# EAGLE design Satellite_Transceiver_Function_Board__Swarm_M138 (EAGLE 9.6.2)
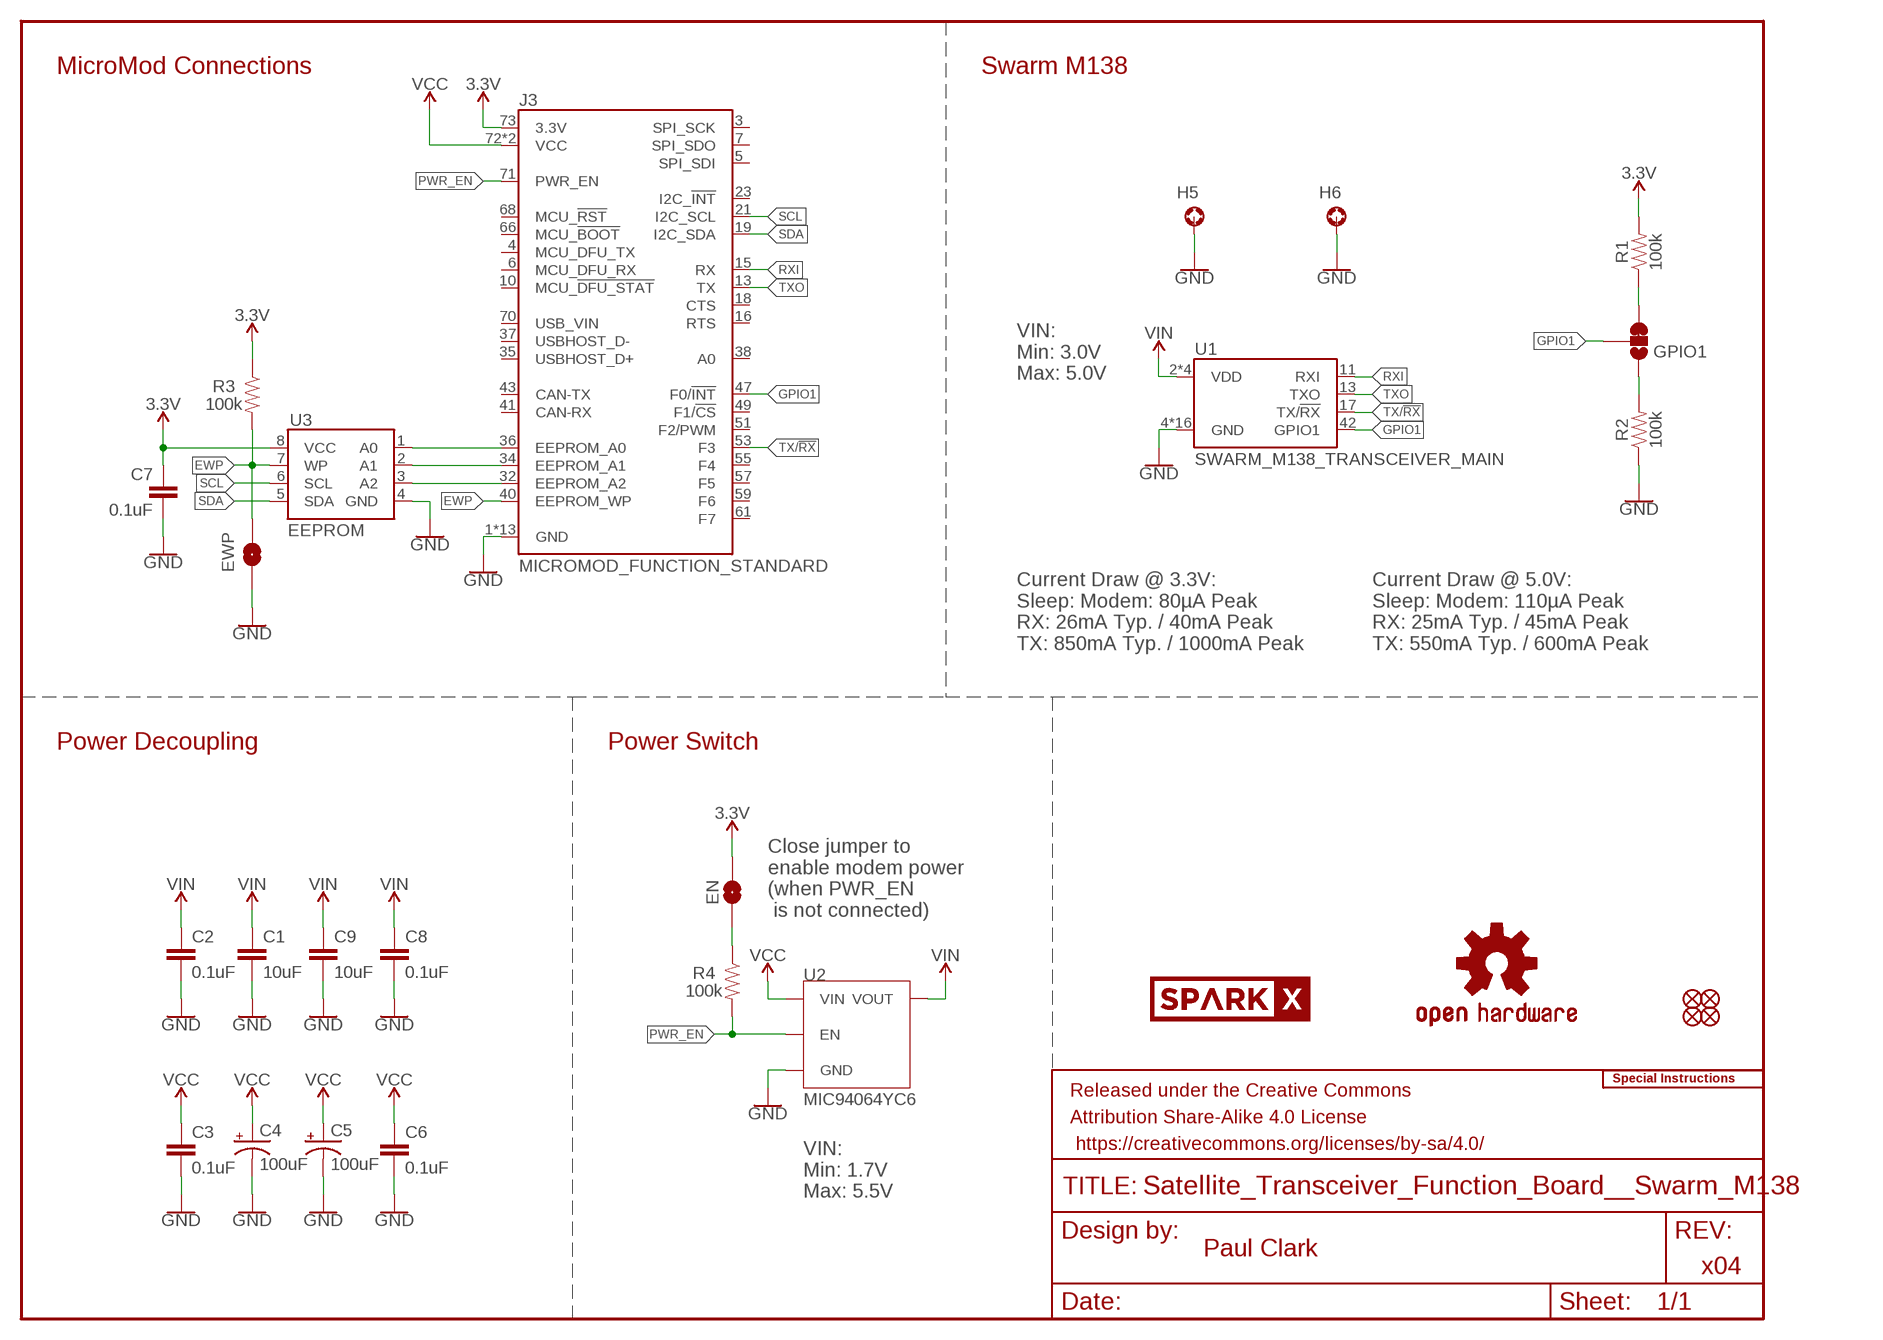
[diagram p0: schematic, sheet 1]

## Parts
C1  10uF  10UF-0603-6.3V-20%  [0603]
C2  0.1uF  0.1UF-0603-25V-5%  [0603]
C3  0.1uF  0.1UF-0603-25V-5%  [0603]
C4  100uF  100UF-POLAR-EIA3528-10V-20%(TANT)  [EIA3528]
C5  100uF  100UF-POLAR-EIA3528-10V-20%(TANT)  [EIA3528]
C6  0.1uF  0.1UF-0603-25V-5%  [0603]
C7  0.1uF  0.1UF-0603-25V-5%  [0603]
C8  0.1uF  0.1UF-0603-25V-5%  [0603]
C9  10uF  10UF-0603-6.3V-20%  [0603]
EN  JUMPER-SMT_2_NO_SILK  [SMT-JUMPER_2_NO_SILK]
EWP  JUMPER-SMT_2_NO_SILK  [SMT-JUMPER_2_NO_SILK]
FD1  FIDUCIAL1X2  [FIDUCIAL-1X2]
FD2  FIDUCIAL1X2  [FIDUCIAL-1X2]
FD3  FIDUCIAL1X2  [FIDUCIAL-1X2]
FD4  FIDUCIAL1X2  [FIDUCIAL-1X2]
FRAME1  FRAME-LETTER  [CREATIVE_COMMONS]
GPIO1  JUMPER-SMT_3_1-NC_TRACE_SILK  [SMT-JUMPER_3_1-NC_TRACE_SILK]
H5  STAND-OFF-REFLOW-M2.5_1.5MM_TALL  [STAND-OFF-REFLOW-M2.5]
H6  STAND-OFF-REFLOW-M2.5_1.5MM_TALL  [STAND-OFF-REFLOW-M2.5]
J3  MICROMOD_FUNCTION_STANDARD  [M.2-CARD-E-22_FUNCTION_STANDARD]
LOGO1  SPECIAL_INSTRUCTIONS-ORDERING  [ORDERING_INSTRUCTIONS]
LOGO2  OSHW-LOGOS  [OSHW-LOGO-S]
R1  100k  100KOHM-0603-1/10W-1%  [0603]
R2  100k  100KOHM-0603-1/10W-1%  [0603]
R3  100k  100KOHM-0603-1/10W-1%  [0603]
R4  100k  100KOHM-0603-1/10W-1%  [0603]
U1  SWARM_M138_TRANSCEIVER_MAIN  [M.2-SWARM-M138-A]
U2  MIC94064YC6  MIC94064/5_MIC94064YC6  [SC-70-6]
U3  EEPROM  EEPROM-I2C512K  [SO08]
U$1  SPARKX-LOGO5  [SPARKX-LARGE]
U$2  SPARKX-LOGO5  [SPARKX-LARGE]

## Nets
3.3V: C7.1 EN.2 J3.73(3.3V) R1.2 R3.1 U3.8(VCC)
A0 [DIGITAL]: J3.36(EEPROM_A0) U3.1(A0)
A1 [DIGITAL]: J3.34(EEPROM_A1) U3.2(A1)
A2 [DIGITAL]: J3.32(EEPROM_A2) U3.3(A2)
EWP [DIGITAL]: EWP.2 J3.40(EEPROM_WP) R3.2 U3.7(WP)
GND: C1.2 C2.2 C3.2 C4.C(-) C5.C(-) C6.2 C7.2 C8.2 C9.2 EWP.1 H5.1 H6.1 J3.1(GND) J3.2(GND) J3.8(GND) J3.33(GND) J3.39(GND) J3.45(GND) J3.75(GND) J3.GND1(GND) J3.GND2(GND) J3.GND3(GND) J3.GND4(GND) J3.GND5(GND) J3.GND6(GND) R2.1 U1.4(GND) U1.9(GND) U1.15(GND) U1.18(GND) U1.21(GND) U1.26(GND) U1.27(GND) U1.29(GND) U1.34(GND) U1.35(GND) U1.37(GND) U1.40(GND) U1.43(GND) U1.50(GND) U1.A1(GND) U1.A2(GND) U2.2(GND) U2.5(GND) U3.4(GND)
GPIO1: GPIO1.2 J3.47(F0/!INT!) U1.42(GPIO1)
N$1: EN.1 R4.1
N$14: GPIO1.3 R1.1
N$16: GPIO1.1 R2.2
PWR_EN: J3.71(PWR_EN) R4.2 U2.3(EN)
RXI: J3.15(RX) U1.11(RXI)
SCL [DIGITAL]: J3.21(I2C_SCL) U3.6(SCL)
SDA [DIGITAL]: J3.19(I2C_SDA) U3.5(SDA)
TX/!RX!: J3.53(F3) U1.17(TX/!RX!)
TXO: J3.13(TX) U1.13(TXO)
VCC: C3.1 C4.A(+) C5.A(+) C6.1 J3.72(VCC) J3.74(VCC) U2.4(VIN)
VIN: C1.1 C2.1 C8.1 C9.1 U1.2(VDD) U1.39(VDD) U1.41(VDD) U1.52(VDD) U2.1(VOUT)
Unconnected: J3.3(SPI_SCK) J3.4(MCU_DFU_TX) J3.5(SPI_SDI) J3.6(MCU_DFU_RX) J3.7(SPI_SDO) J3.10(MCU_!DFU_STAT!) J3.16(RTS) J3.18(CTS) J3.23(I2C_!INT!) J3.35(USBHOST_D+) J3.37(USBHOST_D-) J3.38(A0) J3.41(CAN-RX) J3.43(CAN-TX) J3.49(F1/!CS!) J3.51(F2/PWM) J3.55(F4) J3.57(F5) J3.59(F6) J3.61(F7) J3.66(MCU_!BOOT!) J3.68(MCU_!RST!) J3.70(USB_VIN)

## Notes on the sheet
- MicroMod Connections | Swarm M138
- VIN:
  Min: 3.0V
  Max: 5.0V
- Current Draw @ 3.3V:
  Sleep: Modem: 80µA Peak
  RX: 26mA Typ. / 40mA Peak
  TX: 850mA Typ. / 1000mA Peak
- Current Draw @ 5.0V:
  Sleep: Modem: 110µA Peak
  RX: 25mA Typ. / 45mA Peak
  TX: 550mA Typ. / 600mA Peak
- Power Decoupling | Power Switch
- Close jumper to
  enable modem power
  (when PWR_EN
   is not connected)
- VIN:
  Min: 1.7V
  Max: 5.5V
- Paul Clark
- x04

## Library data of the parts
C1 C9 = SparkFun-Capacitors:10UF: 10.0µF ceramic capacitors A capacitor is a passive two-terminal electrical component used to store electrical energy temporarily in an electric field.; PROD_ID: CAP-11015
C2 C3 C6-C8 = SparkFun-Capacitors:0.1UF: 0.1µF ceramic capacitors A capacitor is a passive two-terminal electrical component used to store electrical energy temporarily in an electric field.; PROD_ID: CAP-08604
C4 C5 = SparkFun-Capacitors:100UF-POLAR: 100µF polarized capacitors A capacitor is a passive two-terminal electrical component used to store electrical energy temporarily in an electric field.; PROD_ID: CAP-16823
EN EWP = SparkFun-Jumpers:JUMPER-SMT_2_NO: Normally open jumper This jumper has two pads in close proximity to each other. Apply solder to close the connection. Round pads are easier to solder for beginners, but are a lot larger. SparkFun Product that uses the round pads: SparkFun EL Sequencer <https://www.sparkfun.com/products/12781>
FD1-FD4 = SparkFun-Aesthetics:FIDUCIAL: Fiducial Alignment Points Point-of-reference for pick-and-place machines and other optical instruments.
FRAME1 = SparkFun-Aesthetics:FRAME-LETTER: Schematic Frame - Letter Standard 8.5x11 US Letter frame
GPIO1 = SparkFun-Jumpers:JUMPER-SMT_3_1-NC_TRACE: Normally closed trace jumper (1 of 2 connections) This jumper has a trace between two pads so it's normally closed (NC). The other connection is normally open (NO). Use a razor knife to open the connection. For best results follow the IPC guidelines for cutting traces: Cutout at least 0.063 mm (0.005 in). Remove all loose material to clean up the cut area. Seal the cut with an approved epoxy. Reapply solder to reclose the connection, or to close the NO connection.
H5 H6 = SparkFun-Hardware:STAND-OFF-REFLOW: Stand Off Reflow Compatible A metal standoff that can be placed and reflowed onto a PCB. The M2.5 x 2.5mm variant is used on MicroMod. The M2.5 x 1.5mm variant is used to hold mPCIe boards, including the Swarm M138. The M2.0 x 6.0mm variant is used to mount the Iridium 9603N modem.; PROD_ID: HW-16629
J3 = SparkFun-MicroMod:MICROMOD_FUNCTION: MicroMod Connector Description: A card edge connector and mating PCB connector to allow various MicroMod Processor Boards to be coupled with various carrier boards of different capabilities. Based on the M.2 standard.
LOGO1 = SparkFun-Aesthetics:SPECIAL_INSTRUCTIONS: Special Ordering/Production Instructions Alert Symbol for special PCB ordering instructions or unique production process warnings. Ordering Instructions Production Instructions Types of information that should be added to box: Copper weight Soldermask color Silk color PCB thickness Number of layers PCB Standard: 1.6mm FR4 1 oz copper immersion silver plating red soldermask white silkscreen Types of information that should be added to box: Special wash requirements Depaneling instructions Humidification Glue curing Default text settings: 0.07 inch 9% ratio 50% line distance
LOGO2 = SparkFun-Aesthetics:OSHW-LOGO: Open-Source Hardware (OSHW) Logo This logo indicates the piece of hardware it is found on incorporates a OSHW license and/or adheres to the definition of open source hardware found here: http://freedomdefined.org/OSHW
R1-R4 = SparkFun-Resistors:100KOHM: 100kΩ resistor A resistor is a passive two-terminal electrical component that implements electrical resistance as a circuit element. Resistors act to reduce current flow, and, at the same time, act to lower voltage levels within circuits. - Wikipedia; PROD_ID: RES-07828
U1 = SparkFun-RF:SWARM_M138_TRANSCEIVER: Swarm M138 Modem Description: A satellite transceiver based on the mPCIe standard.; PROD_ID: CONN-16558
U2 = SparkFun-IC-Power:MIC94064/5: The MIC94064 and MIC94065 are high-side load switches designed for operation between 1.7V to 5.5V. The devices contain a low on-resistance P-channel MOSFET that supports over 2A of continuous current. The MIC94064/5 provides a slew rate controlled SoftStart turn-on of 115µs (typical) to prevent in-rush current from glitching supply rails. The MIC94065 features an active load discharge circuit which insures capacitive loads retain no charge when the main switch is in an OFF state. An active pull-down on the enable input keeps MIC94064/5 in a default OFF state until the EN pin is pulled to a high level. Built-in level shift circuitry allows low voltage logic signals to switch higher supply voltages, or vice versa; high level logic signals can control low level voltages. Datasheet <http://ww1.microchip.com/downloads/en/DeviceDoc/mic94064-5.pdf>; PROD_ID: IC-16794
U3 = SparkFun-IC-Memory:EEPROM-I2C: I2C EEPROMs, 24LC256 and others 24LC256 Series 256 kb I2C 2 Wire (32 k x 8 Bit) 2.5 V Serial EEPROM SMD - SOIC-8 Datasheet SparkFun Products SparkFun UDB5 - PIC UAV Development Board <https://www.sparkfun.com/products/11703> (GPS-11703); PROD_ID: IC-14645
U$1 U$2 = SparkX:SPARKX-LOGO

## Net classes
4 3.3V: width 0.2 mm, clearance 0.2 mm to class 1
10 DIGITAL: width 0.09 mm, clearance 0.1 mm to class 0, clearance 0.1 mm to class 1, clearance 0.1 mm

## Board
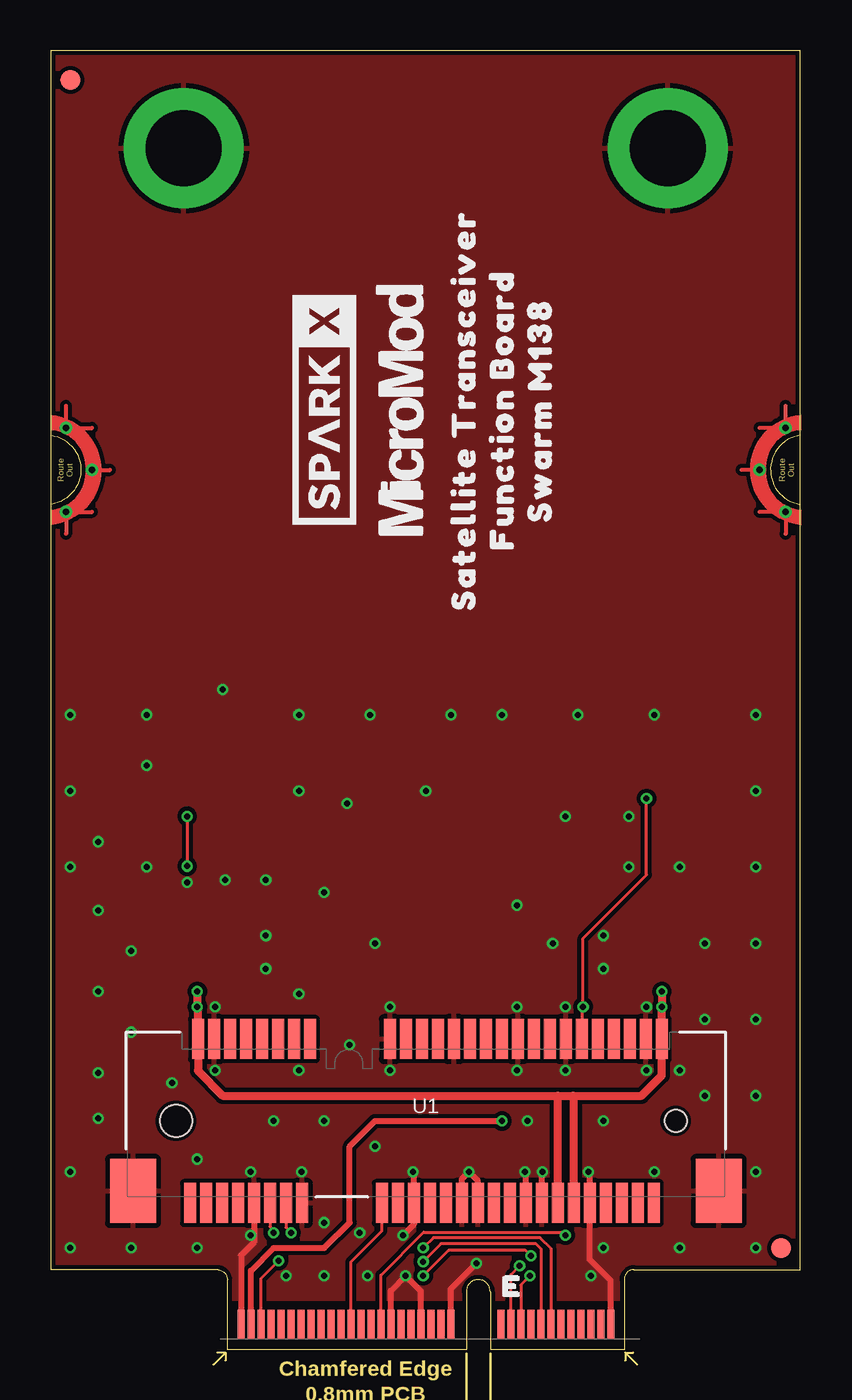
[diagram p1: board, top side]
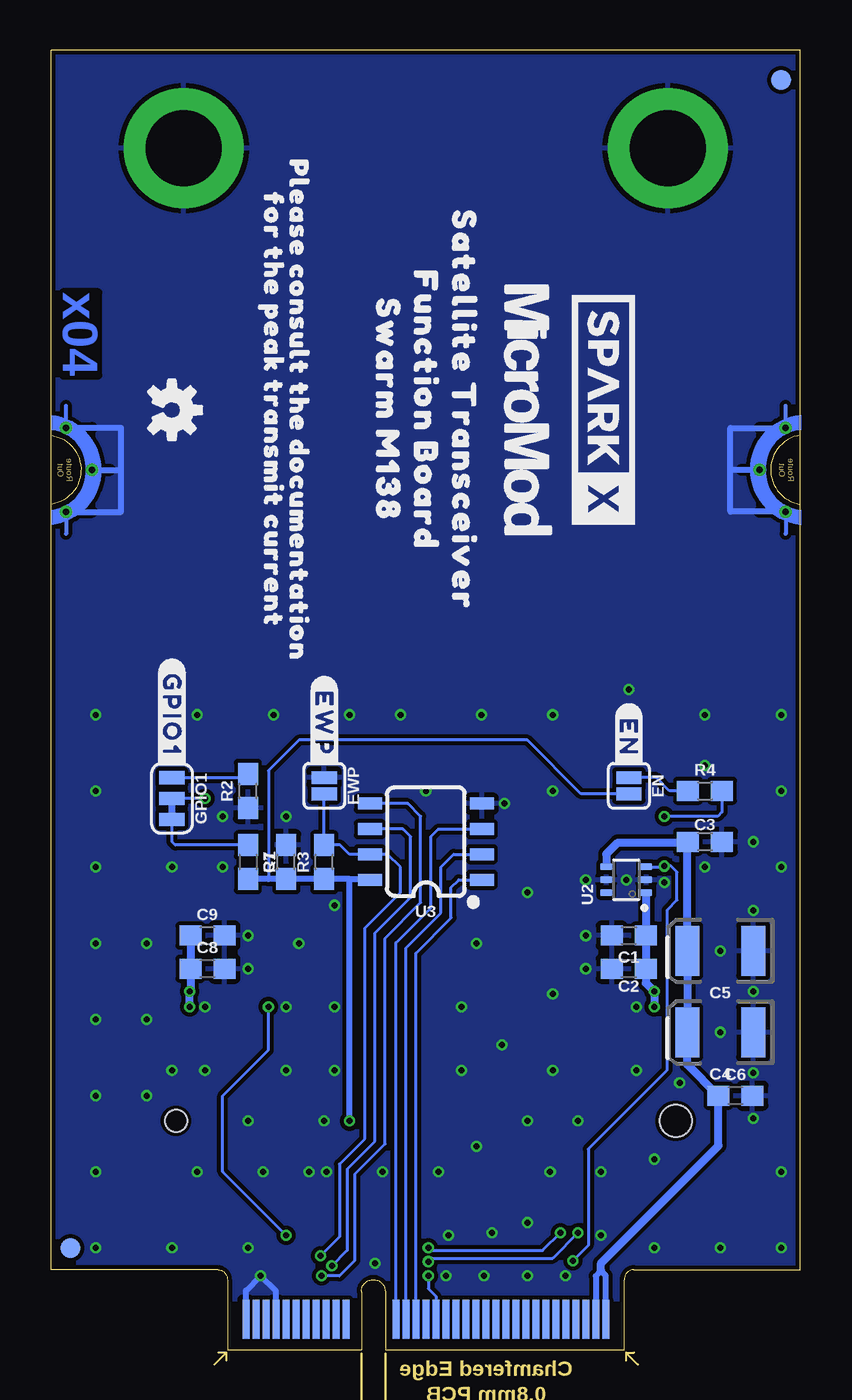
[diagram p2: board, bottom side, seen from below]

Size 37.5 x 65 mm. Coordinates in mm from the lower left corner, seen from the top.
Outline: 28.67,0 21.97,0 21.97,2.9 arc180 20.77,2.9 20.77,0 8.82,0 8.82,3.5 arc84 8.35,4 0,4 0,65 37.49,65 37.49,4 29.15,4 arc85 28.67,3.5 28.67,0
Copper layers (1*16): Top 0.035mm / dielectric 1.5mm / Bottom 0.035mm
Design rules "SparkFun-2-Layer-Minimum-JLCPCB": minimum track width 5mil, minimum drill 0.3mm, track to track 5mil, track to pad 5mil, pad to pad 5mil, via to via 5mil, smd to smd 5mil, copper to edge 7mil, drill to drill 7mil, minimum pad ring 5mil, minimum via ring 5mil, stop-mask expansion 2.5mil, vias tented up to drill 25mil, thermal gap 10mil
tRestrict: 2 lines

### Footprints (pad centres in the part's own frame; a part is rotated, then mirrored left to right if it is on the bottom)
0603 = smd 1.1 x 1: 1 -0.85,0; 2 0.85,0
EIA3528 = smd 1.2 x 2.5: A 1.65,0; C -1.65,0
SMT-JUMPER_2_NO_SILK = smd 0.635 x 1.27: 1 -0.406,0; 2 0.406,0
FIDUCIAL-1X2 = smd 1 x 1: 1 0,0
SMT-JUMPER_3_1-NC_TRACE_SILK = smd 0.66 x 1.27: 1 -1.041,0; 2 0,0; 3 1.041,0
STAND-OFF-REFLOW-M2.5 = drill 3.8 pad 6: 1 0,0
M.2-CARD-E-22_FUNCTION_STANDARD = smd 0.35 x 1.45: 1 9.25,1.275; 3 8.75,1.275; 5 8.25,1.275; 7 7.75,1.275; 9 7.25,1.275; 11 6.75,1.275; 13 6.25,1.275; 15 5.75,1.275; 17 5.25,1.275; 19 4.75,1.275; 21 4.25,1.275; 23 3.75,1.275; 33 1.25,1.275; 35 0.75,1.275; 37 0.25,1.275; 39 -0.25,1.275; 41 -0.75,1.275; 43 -1.25,1.275; 45 -1.75,1.275; 47 -2.25,1.275; 49 -2.75,1.275; 51 -3.25,1.275; 53 -3.75,1.275; 55 -4.25,1.275; 57 -4.75,1.275; 59 -5.25,1.275; 61 -5.75,1.275; 63 -6.25,1.275; 65 -6.75,1.275; 67 -7.25,1.275; 69 -7.75,1.275; 71 -8.25,1.275; 73 -8.75,1.275; 75 -9.25,1.275 | smd 0.35 x 1.95 bottom: 2 9,1.525; 4 8.5,1.525; 6 8,1.525; 8 7.5,1.525; 10 7,1.525; 12 6.5,1.525; 14 6,1.525; 16 5.5,1.525; 18 5,1.525; 20 4.5,1.525; 22 4,1.525; 32 1.5,1.525; 34 1,1.525; 36 0.5,1.525; 38 0,1.525; 40 -0.5,1.525; 42 -1,1.525; 44 -1.5,1.525; 46 -2,1.525; 48 -2.5,1.525; 50 -3,1.525; 52 -3.5,1.525; 54 -4,1.525; 56 -4.5,1.525; 58 -5,1.525; 60 -5.5,1.525; 62 -6,1.525; 64 -6.5,1.525; 66 -7,1.525; 68 -7.5,1.525; 70 -8,1.525; 72 -8.5,1.525; 74 -9,1.525 | drill 0.305 pad 0.61: GND1 -18,41.9; GND2 -16.7,44; GND3 -18,46.1; GND4 18,41.9; GND5 16.7,44; GND6 18,46.1
M.2-SWARM-M138-A = smd 0.6 x 2: 1 -11.8,-4.1; 2 -11.4,4.1; 3 -11,-4.1; 4 -10.6,4.1; 5 -10.2,-4.1; 6 -9.8,4.1; 7 -9.4,-4.1; 8 -9,4.1; 9 -8.6,-4.1; 10 -8.2,4.1; 11 -7.8,-4.1; 12 -7.4,4.1; 13 -7,-4.1; 14 -6.6,4.1; 15 -6.2,-4.1; 16 -5.8,4.1; 17 -2.2,-4.1; 18 -1.8,4.1; 19 -1.4,-4.1; 20 -1,4.1; 21 -0.6,-4.1; 22 -0.2,4.1; 23 0.2,-4.1; 24 0.6,4.1; 25 1,-4.1; 26 1.4,4.1; 27 1.8,-4.1; 28 2.2,4.1; 29 2.6,-4.1; 30 3,4.1; 31 3.4,-4.1; 32 3.8,4.1; 33 4.2,-4.1; 34 4.6,4.1; 35 5,-4.1; 36 5.4,4.1; 37 5.8,-4.1; 38 6.2,4.1; 39 6.6,-4.1; 40 7,4.1; 41 7.4,-4.1; 42 7.8,4.1; 43 8.2,-4.1; 44 8.6,4.1; 45 9,-4.1; 46 9.4,4.1; 47 9.8,-4.1; 48 10.2,4.1; 49 10.6,-4.1; 50 11,4.1; 51 11.4,-4.1; 52 11.8,4.1 | smd 2.3 x 3.2: A1 -14.65,-3.5; A2 14.65,-3.5 | hole 1.1: 12.5,0 | hole 1.6: -12.5,0
SC-70-6 = smd 0.35 x 0.6: 1 -0.65,-1; 2 0,-1; 3 0.65,-1; 4 0.65,1; 5 0,1; 6 -0.65,1
SO08 = smd 0.6 x 1.2: 1 -1.905,-2.8; 2 -0.635,-2.8; 3 0.635,-2.8; 4 1.905,-2.8; 5 1.905,2.8; 6 0.635,2.8; 7 -0.635,2.8; 8 -1.905,2.8

### Placement (x,y rotation side)
C1  8.59,20.7 180 bottom
C2  8.59,19.05 180 bottom
C3  4.78,25.4 0 bottom
C4  4.02,15.88 180 bottom
C5  4.02,19.94 180 bottom
C6  3.25,12.7 0 bottom
C7  25.73,24.38 90 bottom
C8  29.67,19.05 0 bottom
C9  29.67,20.7 0 bottom
EN  8.59,28.19 270 bottom
EWP  23.83,28.19 270 bottom
FD1  36.53,5.08 0 top
FD2  36.53,5.08 0 bottom
FD3  0.97,63.5 0 top
FD4  0.97,63.5 0 bottom
FRAME1  72.09,1.27 0 top  (outside the outline)
GPIO1  31.45,27.56 270 bottom
H5  6.65,60.08 0 top
H6  30.85,60.08 0 top
J3  18.75,0 0 top
LOGO1  44.15,62.23 0 top  (outside the outline)
LOGO2  31.45,46.99 270 bottom
R1  27.64,24.38 270 bottom
R2  27.64,27.94 90 bottom
R3  23.83,24.38 90 bottom
R4  4.78,27.94 0 bottom
U1  18.75,11.43 0 top
U2  8.71,23.5 90 bottom
U3  18.75,25.4 90 bottom
U$1  9.86,46.99 270 bottom
U$2  13.67,46.99 90 top
U$3  [FUNCTION_BOARD0]  22.56,46.99 90 top
U$4  [SATELLITE_TRANSCEIVER0]  20.65,46.99 90 top
U$5  [SATELLITE_TRANSCEIVER0]  16.84,46.99 270 bottom
U$6  [PLEASE_CONSULT_THE_DOCUMENTATION0]  25.1,46.99 270 bottom
U$7  [FUNCTION_BOARD0]  18.75,46.99 270 bottom
U$8  [#EWP#0]  23.83,28.96 270 bottom
U$9  [MICROMOD_LOGO_.5]  17.48,46.99 90 top
U$10  [MICROMOD_LOGO_.5]  13.67,46.99 270 bottom
U$11  [#EN#0]  8.59,28.96 270 bottom
U$19  [#GPIO1#0]  31.45,28.96 270 bottom
U$31  [FOR_THE_PEAK_TRANSMIT_CURRENT1]  26.37,46.99 270 bottom
U$40  [SWARM_M1381]  24.46,46.99 90 top
U$41  [SWARM_M1381]  20.65,46.99 270 bottom

### Tracks (layer width: path | path; a pad name or v marks a point on that pad's centre or on a via)
3.3V  (via drill 0.3)
  Top 0.305: J3.73 10,3.95 11.13,5.08 13.67,5.08 14.94,6.35 14.94,10.16 16.21,11.43 v22.56,11.43
  Bottom 0.152: EN.2 10.97,27.79 13.67,30.48 25.1,30.48 26.62,28.96 26.62,23.53
  Bottom 0.305: v22.56,11.43 22.56,23.53 | 22.56,23.53 R3.1 C7.1 26.62,23.53 R1.2 | 22.56,23.53 21.59,23.53 U3.8
A0
  Bottom 0.152: U3.1 17.1,23.5 17.48,23.11 17.48,21.59 19.25,19.82 J3.36
A1
  Bottom 0.152: U3.2 17.35,24.77 17.98,24.13 17.98,21.84 19.75,20.08 J3.34
A2
  Bottom 0.152: J3.32 20.25,20.34 18.49,22.1 18.49,25.65 18.11,26.04 U3.3
EWP  (via drill 0.3)
  Top 0.152: v24.02,4.68 23.75,4.95 19.89,4.95 v18.62,3.68
  Bottom 0.152: v24.02,4.68 23.06,5.63 23.06,9.27 21.8,10.54 21.8,21.08 20.02,22.86 20.02,24.13 20.65,24.77 U3.7 22.56,24.77 23.03,25.23 R3.2 EWP.2 | v18.62,3.68 18.62,3.05 18.25,2.67 J3.40
GND  (via drill 0.3)
  Top 0.305: J3.1 28,3.45 26.95,4.5 U1.43 26.95,8.82 v26.88,8.89 | U1.9 10.15,5.37 9.5,4.72 J3.75 | J3.33 20,3.03 v21.29,4.32 | U1.27 20.55,8.53 v20.91,8.89 21.35,8.45 U1.29 | v18.11,8.89 18.15,8.86 U1.21 18.15,6.26 v17.6,5.71 | U1.35 23.75,8.84 v23.7,8.89 | U1.37 24.55,8.85 v24.59,8.89 | J3.39 18.5,2.92 v17.73,3.68 17,2.95 J3.45
  Bottom 0.305: J3.GND1 3.51,41.91 3.51,44 | J3.GND3 3.51,46.1 3.51,44 | J3.GND2 3.51,44 | J3.GND5 33.99,44 | J3.GND6 33.99,46.1 33.99,44 | J3.GND4 33.99,41.9 33.99,44 | J3.8 26.25,2.93 v27,3.68 27.75,2.94 J3.2
  other vias: 16.97,13.97 23.32,13.97 25.73,13.97 29.8,13.97 2.36,25.4 9.98,8.89 8.21,13.97 12.52,8.89 27.64,19.05 25.73,17.14 23.32,17.14 16.97,17.14 29.8,17.14 31.45,13.97 27.64,11.43 16.21,10.16 13.67,11.43 13.67,6.35 15.45,5.84 13.67,3.68 7.32,5.08 0.97,5.08 2.36,17.91 2.36,21.97 0.97,31.75 4.78,31.75 8.59,33.02 12.4,31.75 15.95,31.75 20.02,31.75 22.56,31.75 35.26,31.75 12.4,27.94 30.18,31.75 35.26,24.13 26.37,31.75 8.21,17.14 12.4,17.78 12.4,13.97 2.36,13.84 11.13,11.43 30.18,8.89 31.45,5.08 35.26,27.94 2.36,11.56 4.02,5.08 15.83,3.68 9.98,5.71 23.83,11.43 11.76,3.68 35.26,5.08 8.71,23.5 6.81,23.37 10.75,23.5 7.32,9.53 6.05,13.34 0.97,8.89 4.02,19.94 4.02,15.88 10.75,20.7 10.75,19.05 4.78,29.21 0.97,27.94 27.64,20.7 14.81,27.3 25.73,26.67 0.97,24.13 4.78,24.13 31.45,24.13 35.26,20.32 35.26,16.51 35.26,12.7 35.26,8.89 32.72,20.32 32.72,16.51 32.72,12.7 25.1,20.32 16.21,20.32 14.94,15.24 13.67,22.86 23.32,22.23 18.75,27.94 27.64,5.08 28.91,24.13 28.91,26.67
  pour Top (isolate 0.203): -0.3,2.54 -0.3,66.04 37.8,66.04 37.8,2.54
  pour Bottom (isolate 0.203): -0.3,2.54 -0.3,66.04 37.8,66.04 37.8,2.54
GPIO1  (via drill 0.3)
  Top 0.152: J3.47 16.5,3.72 18.64,5.87 25.58,5.87 v25.73,5.71 | U1.42 26.55,17.07 v26.62,17.14 26.62,20.57 29.8,23.75 v29.8,27.56
  Bottom 0.152: v25.73,5.71 28.91,8.89 28.91,12.7 26.62,14.99 v26.62,17.14 | v29.8,27.56 GPIO1.2
N$1
  Bottom 0.152: R4.1 6.55,27.94 7.21,28.6 EN.1
N$14
  Bottom 0.152: R1.1 31.28,25.23 31.45,25.4 GPIO1.3
N$16
  Bottom 0.152: GPIO1.1 27.83,28.6 R2.2
PWR_EN  (via drill 0.3)
  Top 0.152: J3.71 10.5,3.56 v11.38,4.45 | v6.81,26.67 v6.81,24.18
  Bottom 0.152: v11.38,4.45 10.62,5.21 10.62,10.03 6.68,13.97 6.68,21.97 6.17,22.48 6.17,23.88 6.47,24.18 v6.81,24.18 6.84,24.14 U2.3 | R4.2 3.93,26.89 4.14,26.67 v6.81,26.67
RXI  (via drill 0.3)
  Top 0.152: U1.11 10.95,6.15 11.13,5.97 v11.13,5.84 | v18.62,4.4 19.51,5.29 24.25,5.29 24.5,5.04 J3.15
  Bottom 0.152: v11.13,5.84 12.4,4.57 18.45,4.57 v18.62,4.4
SCL  (via drill 0.3)
  Top 0.152: J3.21 23,3.74 v23.45,4.19
  Bottom 0.152: v23.45,4.19 22.68,4.95 22.68,9.02 21.29,10.41 21.29,20.83 19.51,22.61 19.51,25.65 19.89,26.04 U3.6
SDA  (via drill 0.3)
  Top 0.152: v23.95,3.68 23.5,3.23 J3.19
  Bottom 0.152: v23.95,3.68 23.06,3.68 22.3,4.45 22.3,8.76 20.78,10.29 20.78,20.57 19,22.35 19,26.67 19.64,27.3 U3.5
TX/!RX!
  Top 0.152: J3.53 15,4.38 16.55,5.93 U1.17
TXO  (via drill 0.3)
  Top 0.152: U1.13 11.75,6.11 v12.02,5.84 | J3.13 25,5.05 24.46,5.59 19.13,5.59 v18.62,5.08
  Bottom 0.152: v18.62,5.08 18.49,4.95 12.91,4.95 v12.02,5.84
VCC
  Bottom 0.305: J3.74 9.75,3.7 9.98,3.94 10.25,3.67 J3.72 | 9.71,24.24 U2.4
  Bottom 0.406: 9.98,3.94 9.98,4.32 4.1,10.2 C6.1 5.66,14.26 C4.A C5.A 5.66,25.36 | 9.71,24.24 9.71,24.78 9.13,25.36 5.66,25.36 | 5.66,25.36 C3.1
VIN  (via drill 0.3)
  Top 0.406: 25.35,12.7 8.59,12.7 7.35,13.94 U1.2 7.35,17.11 v7.32,17.14 v7.32,17.91 | 25.35,12.7 26.11,12.7 | 26.11,12.7 29.54,12.7 30.55,13.71 U1.52 v30.55,17.13 v30.56,17.14 v30.56,17.91 | U1.39 25.35,12.7 | U1.41 26.15,12.67 26.11,12.7
  Bottom 0.305: 7.71,22.62 U2.1
  Bottom 0.406: v7.32,17.14 v7.32,17.91 7.74,18.33 C2.1 C1.1 7.71,20.72 7.71,22.62 | v30.56,17.14 v30.56,17.91 30.52,17.95 C8.1 C9.1

### Text on the board
Bottom: x04
Measures: Dimensions in mm
tDocu: 2-Layer Board / 0.8mm Thickness / 1oz Copper / ENIG Finish / Chamfered Edge | Paul Clark